# EAGLE design STEP CON Mk 05C - With Voltage Regulator (EAGLE 7.6.0)
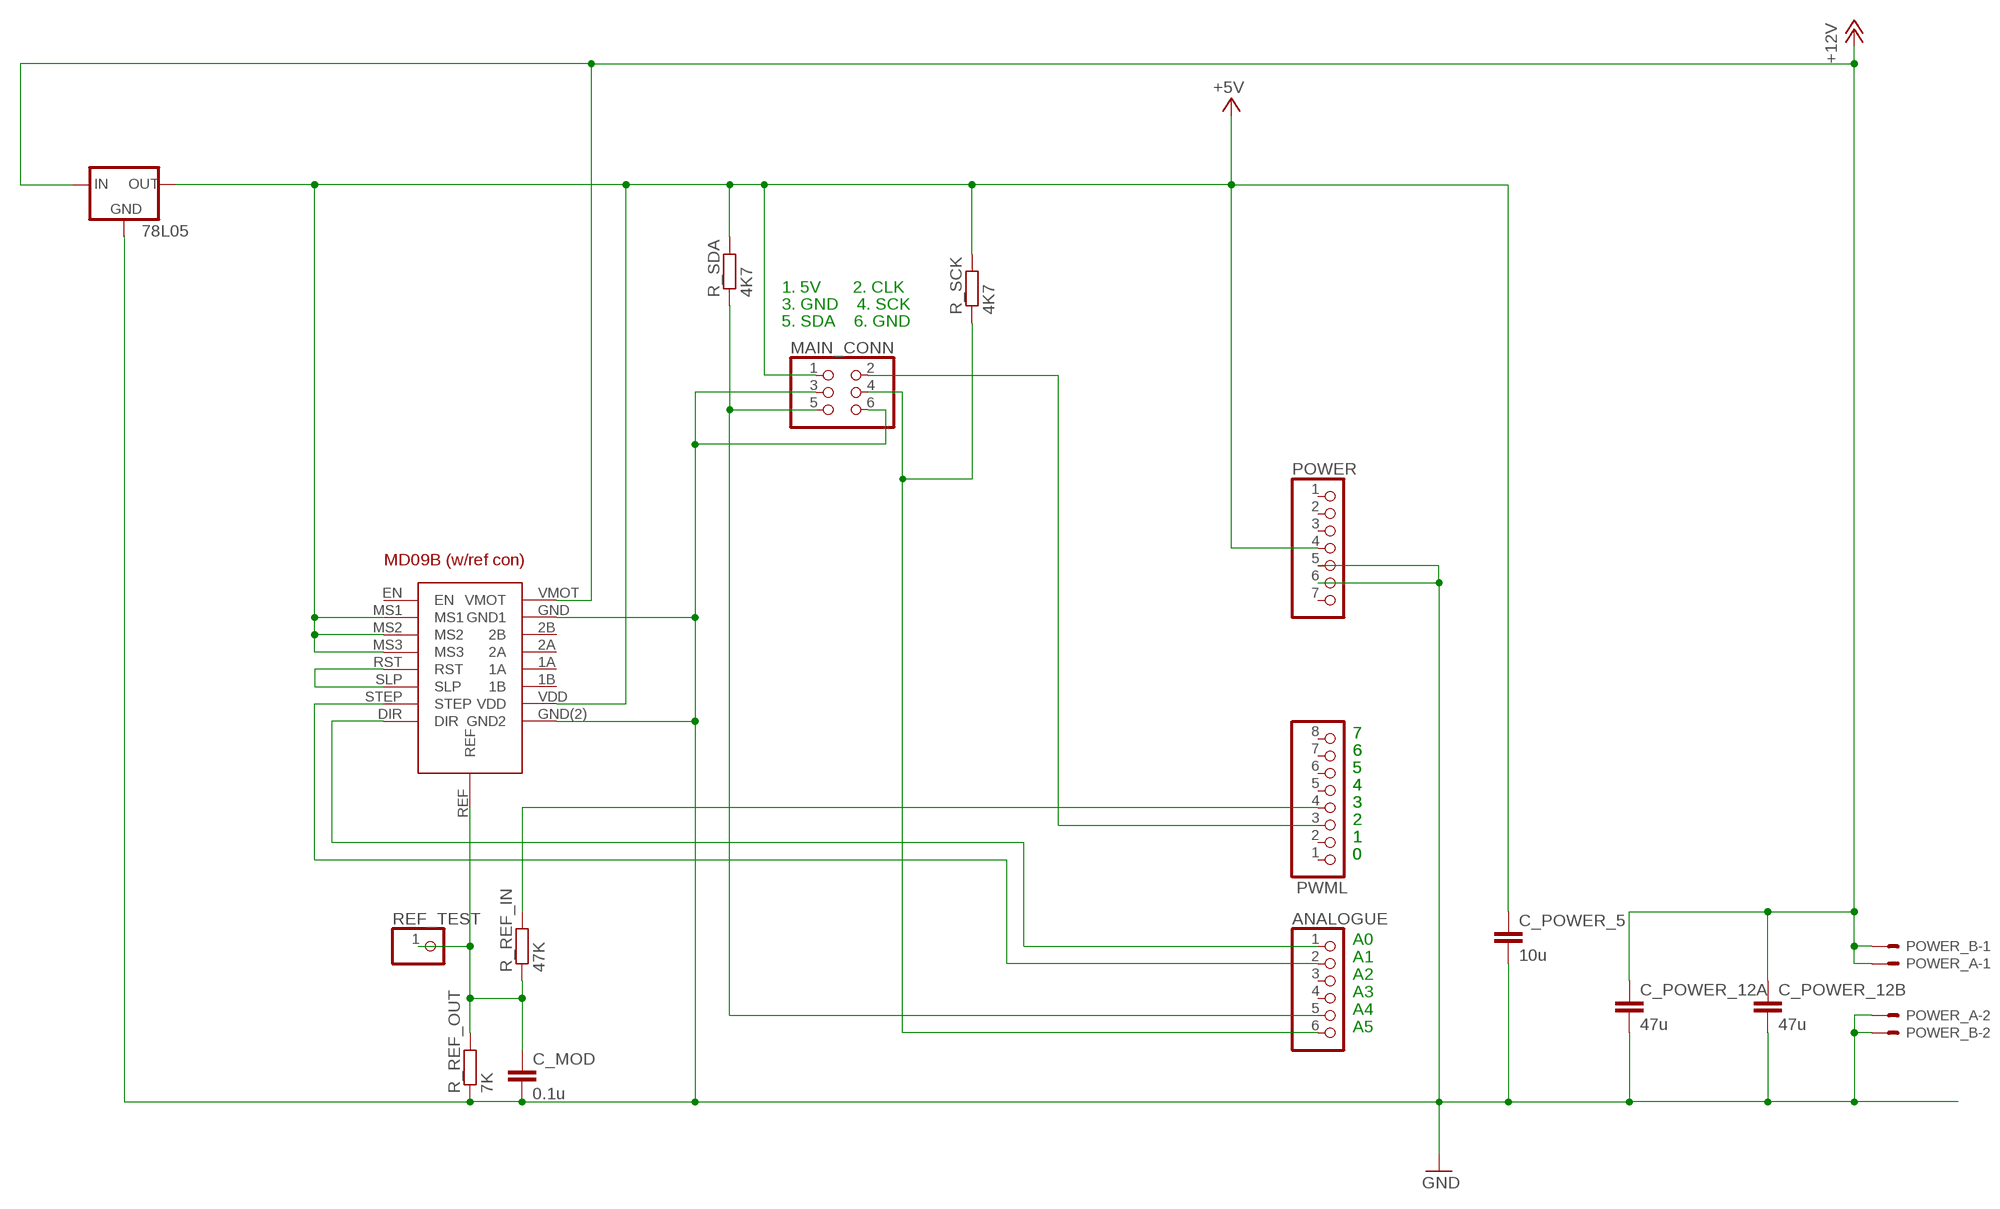
[diagram p0: schematic, sheet 1]

## Parts
78L05  78LXX  [78LXX]
ANALOGUE  PINHD-1X6  [1X06]
C_MOD  0.1u  C-EUC1206  [C1206]
C_POWER_5  10u  C-EUC1206  [C1206]
C_POWER_12A  47u  C-EUC1206  [C1206]
C_POWER_12B  47u  C-EUC1206  [C1206]
MAIN_CONN  PINHD-2X3  [2X03]
POWER  PINHD-1X7  [1X07]
POWER_A  KK-156-2  [KK-156-2]
POWER_B  KK-156-2  [KK-156-2]
PWML  PINHD-1X8  [1X08]
R_REF_IN  47K  R-EU_M0805  [M0805]
R_REF_OUT  7K  R-EU_M0805  [M0805]
R_SCK  4K7  R-EU_M0805  [M0805]
R_SDA  4K7  R-EU_M0805  [M0805]
REF_TEST  PINHD-1X1  [1X01]
U$1  MD09B_MOD_LP  [MD90B_MOD_LP]

## Nets
+5V [usbvcc]: 78L05.OUT C_POWER_5.1 MAIN_CONN.1 POWER.4 R_SCK.2 R_SDA.2 U$1.MS1 U$1.MS2 U$1.MS3 U$1.VDD
+12V: 78L05.IN C_POWER_12A.1 C_POWER_12B.1 POWER_A.1 POWER_B.1 U$1.VMOT
DIR: ANALOGUE.1 U$1.DIR
GND [gnd]: 78L05.GND C_MOD.2 C_POWER_5.2 C_POWER_12A.2 C_POWER_12B.2 MAIN_CONN.3 MAIN_CONN.6 POWER.5 POWER.6 POWER_A.2 POWER_B.2 R_REF_OUT.1 U$1.GND(2)(GND2) U$1.GND(GND1)
PWM: PWML.4 R_REF_IN.2
REF1: C_MOD.1 R_REF_IN.1 R_REF_OUT.2 REF_TEST.1 U$1.REF
SCK: ANALOGUE.6 MAIN_CONN.4 R_SCK.1
SDA: ANALOGUE.5 MAIN_CONN.5 R_SDA.1
SKYCLOCK: MAIN_CONN.2 PWML.3
SLP-RST: U$1.RST U$1.SLP
STEP: ANALOGUE.2 U$1.STEP
Unconnected: ANALOGUE.3 ANALOGUE.4 POWER.1 POWER.2 POWER.3 POWER.7 PWML.1 PWML.2 PWML.5 PWML.6 PWML.7 PWML.8 U$1.1A U$1.1B U$1.2A U$1.2B U$1.EN

## Notes on the sheet
- 1. 5V       2. CLK
  3. GND    4. SCK
  5. SDA    6. GND
- 7 | 7
- 6 | 6
- 5 | 5
- 4 | 4
- 3 | 3
- 2 | 2
- 1 | 1
- 0 | 0
- A0
  A1
  A2
  A3
  A4
  A5

## Library data of the parts
78L05 = v-reg:78LXX: VOLTAGE REGULATOR
ANALOGUE = pinhead - big pad:PINHD-1X6: PIN HEADER
C_MOD C_POWER_5 C_POWER_12A C_POWER_12B = rcl:C-EU: CAPACITOR, European symbol
MAIN_CONN = pinhead - big pad:PINHD-2X3: PIN HEADER
POWER = pinhead - big pad:PINHD-1X7: PIN HEADER
POWER_A POWER_B = con-molex:KK-156-2: KK 156 HEADER Source: http://www.molex.com/pdm_docs/sd/026604100_sd.pdf; OC_FARNELL: unknown; OC_NEWARK: unknown
PWML = pinhead:PINHD-1X8: PIN HEADER
R_REF_IN R_REF_OUT R_SCK R_SDA = rcl:R-EU_: RESISTOR, European symbol
REF_TEST = pinhead:PINHD-1X1: PIN HEADER
U$1 = pololu:MD09B_MOD_LP

## Net classes
1 power: width 0.61 mm, drill 0.711 mm, clearance 0.203 mm
2 gnd: width 0.305 mm, drill 0.711 mm, clearance 0.203 mm
3 usbvcc: width 0.508 mm, drill 0.711 mm, clearance 0.203 mm

## Board
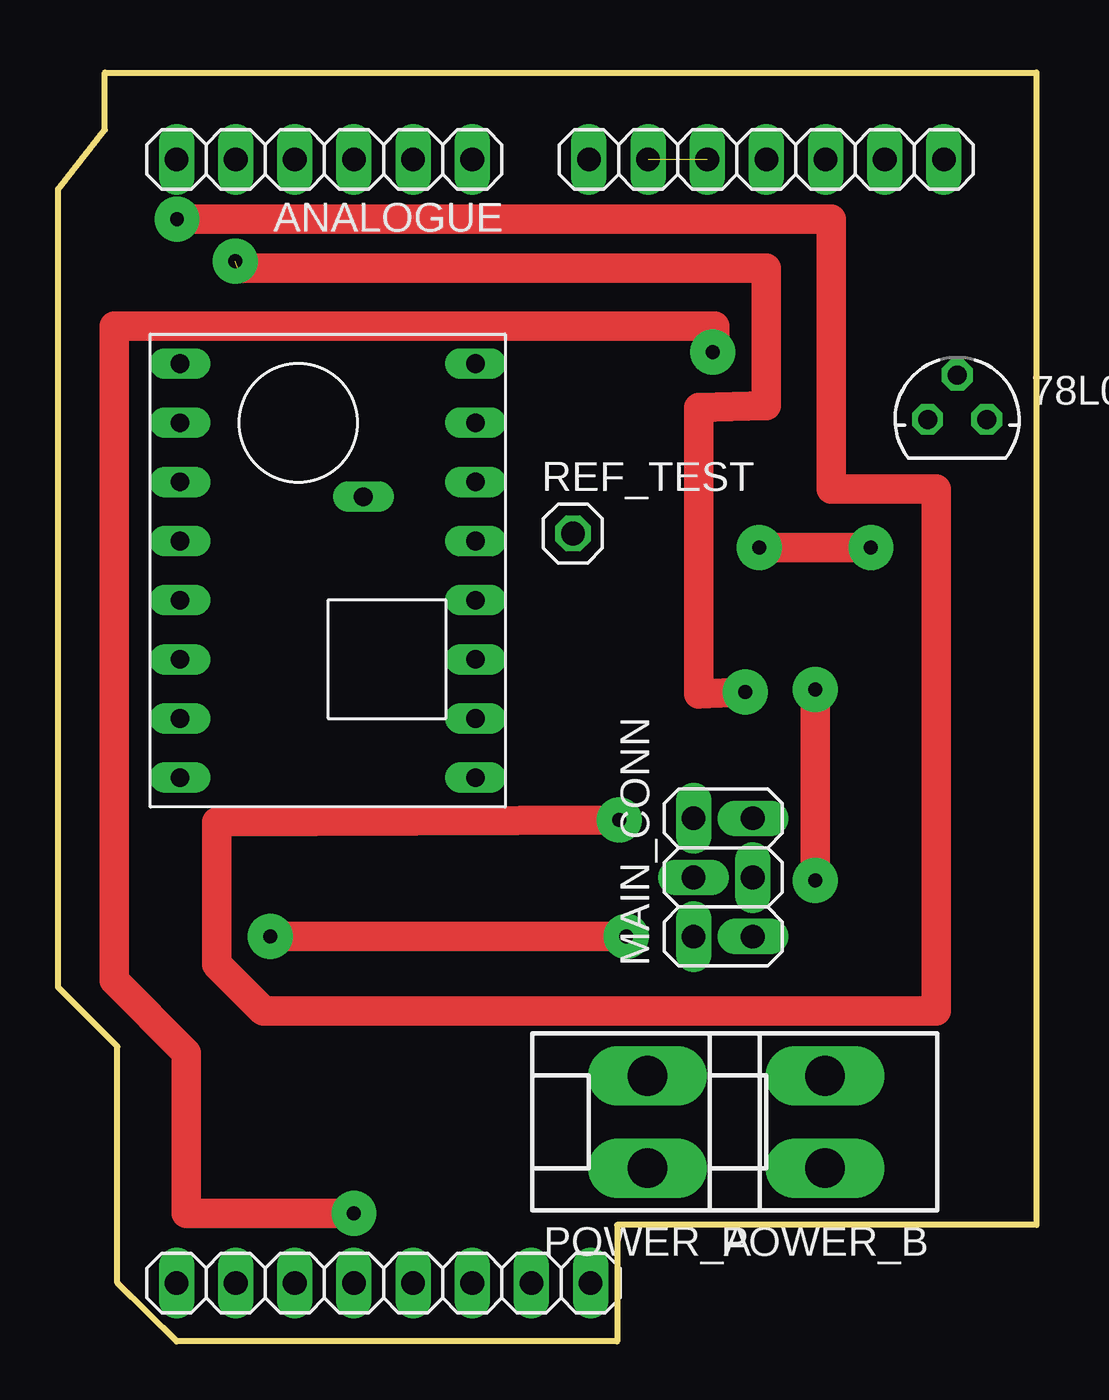
[diagram p1: board, top side]
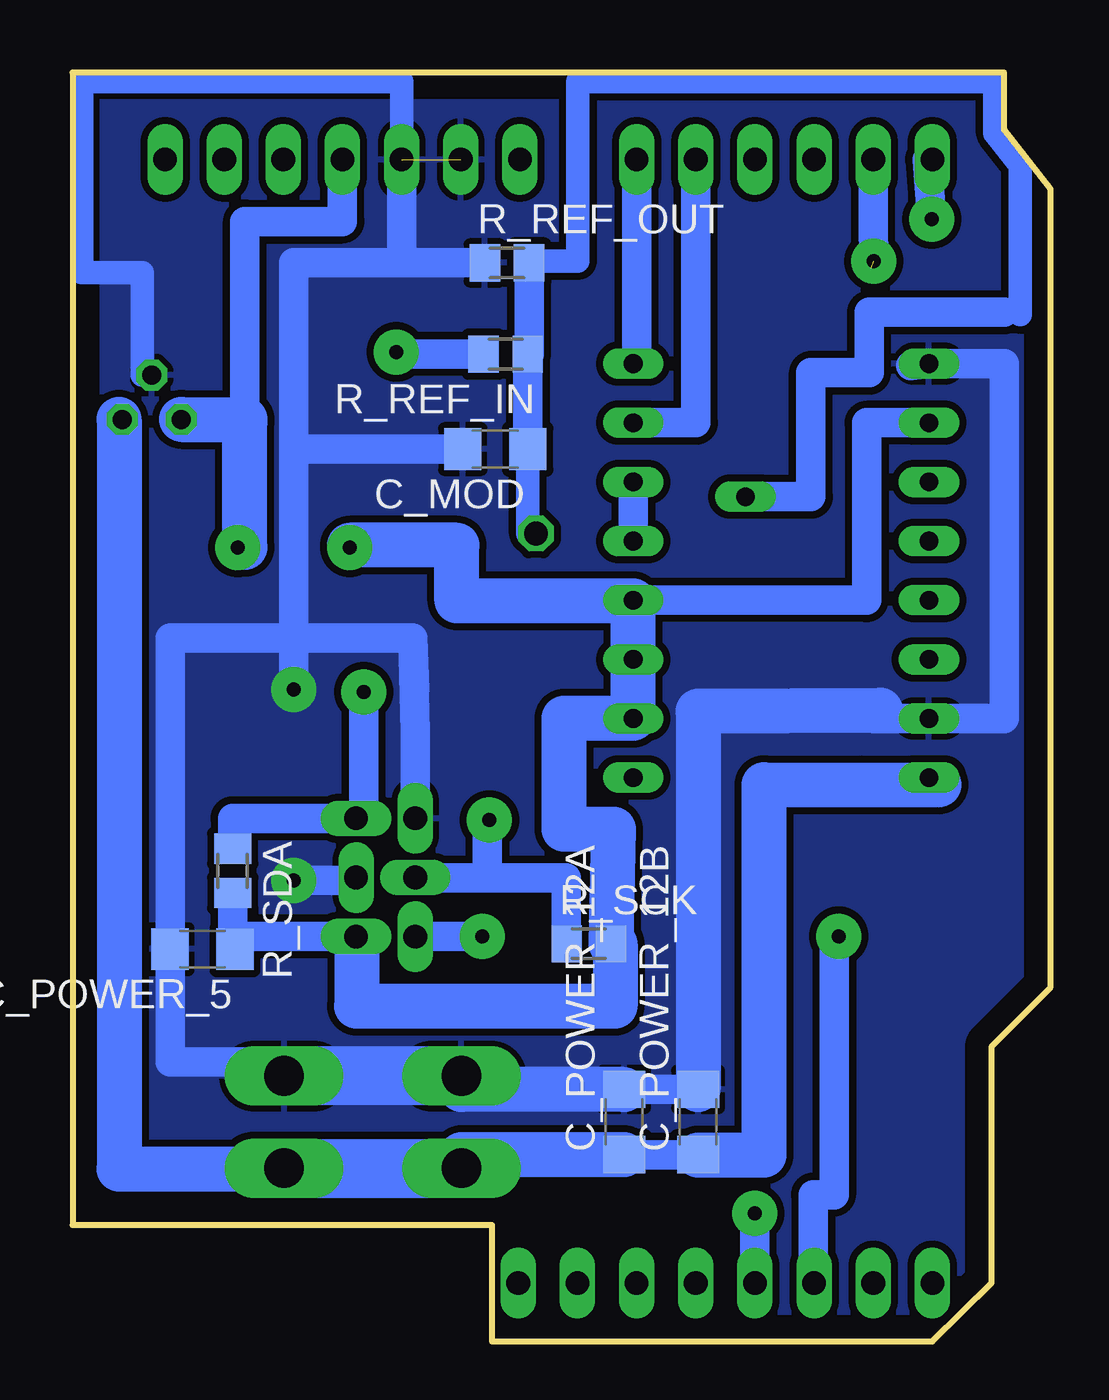
[diagram p2: board, bottom side, seen from below]

Size 42 x 54.5 mm. Coordinates in mm from the lower left corner, seen from the top.
Outline: 24,0 5.08,0 2.54,2.5 2.54,12.66 0,15.21 0,49.49 2,52.03 2,54.5 42,54.5 42,5 24,5 24,0
Copper layers (1*16): Top 0.035mm / dielectric 1.5mm / Bottom 0.035mm
Design rules "default *": minimum track width 8mil, minimum drill 16mil, track to track 12mil, track to pad 12mil, pad to pad 12mil, via to via 12mil, smd to smd 8mil, copper to edge 40mil, drill to drill 12mil, minimum pad ring 10mil, minimum via ring 10mil, stop-mask expansion 4mil, vias tented up to drill 0mil, thermal gap 10mil

### Footprints (pad centres in the part's own frame; a part is rotated, then mirrored left to right if it is on the bottom)
78LXX = drill 0.813 octagon: GND 0,1.905; IN 1.27,0; OUT -1.27,0
1X06 = drill 1.016 long: 1 -6.35,0; 2 -3.81,0; 3 -1.27,0; 4 1.27,0; 5 3.81,0; 6 6.35,0
C1206 = smd 1.6 x 1.8: 1 -1.4,0; 2 1.4,0
2X03 = drill 1.016 long: 1 -2.54,-1.27; 2 -2.54,1.27; 3 0,-1.27; 4 0,1.27; 5 2.54,-1.27; 6 2.54,1.27
1X07 = drill 1.016 long: 1 -7.62,0; 2 -5.08,0; 3 -2.54,0; 4 0,0; 5 2.54,0; 6 5.08,0; 7 7.62,0
KK-156-2 = drill 1.7 pad 2.184 long: 1 -1.98,0; 2 1.98,0
1X08 = drill 1.016 long: 1 -8.89,0; 2 -6.35,0; 3 -3.81,0; 4 -1.27,0; 5 1.27,0; 6 3.81,0; 7 6.35,0; 8 8.89,0
M0805 = smd 1.3 x 1.6: 1 -0.95,0; 2 0.95,0
1X01 = drill 1.016 octagon: 1 0,0
MD90B_MOD_LP = drill 0.8 long: 1A 6.35,-1.27; 1B 6.35,-3.81; 2A 6.35,1.27; 2B 6.35,3.81; DIR -6.35,-8.89; EN -6.35,8.89; GND 6.35,6.35; GND(2) 6.35,-8.89; MS1 -6.35,6.35; MS2 -6.35,3.81; MS3 -6.35,1.27; REF -1.524,-3.175; RST -6.35,-1.27; SLP -6.35,-3.81; STEP -6.35,-6.35; VDD 6.35,-6.35; VMOT 6.35,8.89

### Placement (x,y rotation side)
78L05  38.6,39.6 0 top
ANALOGUE  11.43,50.77 180 top
C_MOD  23.85,38.33 180 bottom
C_POWER_5  36.42,16.84 180 bottom
C_POWER_12A  18.32,9.42 90 bottom
C_POWER_12B  15.14,9.42 90 bottom
MAIN_CONN  28.55,19.93 90 top
POWER  30.41,50.77 180 top
POWER_A  25.3,9.42 90 top
POWER_B  32.92,9.42 90 top
PWML  13.97,2.5 0 top
R_REF_IN  23.41,42.41 180 bottom
R_REF_OUT  23.34,46.33 0 bottom
R_SCK  19.83,17.07 0 bottom
R_SDA  35.12,20.21 270 bottom
REF_TEST  22.1,34.7 0 top
U$1  11.57,33.1 180 top

### Tracks (layer width: path | path; a pad name or v marks a point on that pad's centre or on a via)
+5V  (via drill 0.6 pad 1.93)
  Top 1.27: v30.1,34.1 v34.9,34.1
  Bottom 1.016: MAIN_CONN.1 29.8,17.1 | 34.6,39.6 34.6,39.5
  Bottom 1.27: MAIN_CONN.1 35,17.39 | 35,17.39 35.12,17.39 R_SDA.2 | R_SCK.2 18.7,17.07 | 17.93,31.8 U$1.MS3 7.9,31.84 7.9,39.45 U$1.VDD | C_POWER_5.1 35,16.84 35,17.39 | 30.1,34.2 v30.1,34.1 | v34.9,34.1 34.6,34.1 | 34.6,39.5 34.6,48.1 30.41,48.1 POWER.4
  Bottom 1.93: 29.8,17.1 29.8,14.4 18.7,14.4 18.7,17.07 | R_SCK.2 18.78,22 20.9,22 20.9,26.75 U$1.MS1 U$1.MS2 17.93,31.8 25.5,31.8 25.5,34.2 30.1,34.2 | 34.6,34.1 34.6,39.5 | 78L05.OUT 34.6,39.6
+12V
  Bottom 1.016: 78L05.IN 40,39.6 | 32.4,7.4 32.4,7.44
  Bottom 1.27: 25.3,8.02 POWER_A.1 | C_POWER_12A.1 C_POWER_12B.1 15.14,8 | 4.8,23.9 8.2,24.21 U$1.VMOT
  Bottom 1.93: C_POWER_12A.1 25.3,8.02 | 15.14,8 12.3,8 12.3,23.91 4.8,23.9 | 40,39.6 40,7.4 32.4,7.4
  Bottom 2.54: POWER_B.1 32.4,7.44 POWER_A.1
DIR
  Bottom 1.27: U$1.DIR 17.78,41.99 ANALOGUE.1
GND  (via drill 0.6 pad 1.93)  (1 unrouted)
  Top 1.27: v32.5,19.8 v32.5,28
  Bottom 1.016: 78L05.GND 39,41.51 39,45.9 41.6,45.9 41.6,54.1 27.87,54.1 POWER.5
  Bottom 1.27: 25.3,10.82 POWER_A.2 | 6,41.9 U$1.GND(2) 2,42 2,26.75 U$1.GND 7.6,26.75 7.3,27.1 | POWER_B.2 32.92,12 37.8,12 37.8,16.84 | 37.8,16.84 37.8,30.2 32.5,30.2 | 32.5,30.2 27.4,30.2 | MAIN_CONN.3 29.82,19.8 v32.5,19.8 | 27.3,28 27.4,30.2 | C_POWER_12B.2 C_POWER_12A.2 | 27.87,46.33 32.5,46.33 32.5,38.33 | 32.5,38.33 32.5,30.2 | C_MOD.2 32.5,38.33 | C_POWER_5.2 37.8,16.84 | R_REF_OUT.1 27.87,46.33 | 27.87,46.33 POWER.5 | 27.4,30.2 27.29,26.2 MAIN_CONN.6 | v32.5,28 32.5,30.2
  Bottom 1.93: C_POWER_12A.2 25.3,10.82 | 7.3,27.1 15.14,27.05 C_POWER_12B.2
  Bottom 2.54: POWER_A.2 POWER_B.2
  pour Bottom: 2,54.5 42,54.5 42,5.1 24,5 24,0 5.2,0 2.54,2.5 2.54,12.6 0,15.1 0,49.5 2,52.1
PWM  (via drill 0.6 pad 1.93)
  Top 1.27: v28.1,42.5 28.2,42.5 28.2,43.6 2.4,43.6 2.4,15.5 5.5,12.4 5.5,5.5 v12.7,5.5
  Bottom 1.27: R_REF_IN.2 28.1,42.41 v28.1,42.5 | PWML.4 v12.7,5.5
REF1
  Bottom 0.61: 2,44.2 1.3,44.1 | 22.39,46.4 R_REF_OUT.2
  Bottom 1.016: 1.3,44.1 1.3,50.5 2.4,51.9 2.4,54.1 20.3,54.1 20.3,46.4 22.39,46.4 | REF_TEST.1 22.45,34.7 C_MOD.1
  Bottom 1.27: U$1.REF 10.3,36.28 10.3,41.6 7.8,41.6 7.8,44.2 2,44.2 | R_REF_OUT.2 22.39,42.41 R_REF_IN.1 C_MOD.1
SCK  (via drill 0.6 pad 1.93)
  Top 1.27: v5.1,48.2 33.2,48.2 33.2,36.6 37.7,36.6 37.7,14.2 8.8,14.2 6.8,16.2 6.8,22.3 v24.1,22.4
  Bottom 1.27: R_SCK.1 20.8,17.07 20.8,19.9 24.2,19.9 | 24.2,19.9 27.29,19.9 MAIN_CONN.4 | ANALOGUE.6 5.3,50.77 v5.1,48.2 | v24.1,22.4 24.2,22.3 24.2,19.9
SDA  (via drill 0.6 pad 1.93)  (1 unrouted)
  Top 1.27: v29.5,27.9 27.5,27.8 27.5,40.1 30.4,40.2 30.4,46.1 7.7,46.1
  Bottom 1.27: R_SDA.1 35.12,22.46 MAIN_CONN.5 29.5,22.46 v29.5,27.9 | v7.6,46.4 7.62,48.1 ANALOGUE.5
SKYCLOCK  (via drill 0.6 pad 1.93)
  Top 1.27: v24.4,17.4 v9.1,17.4
  Bottom 1.27: MAIN_CONN.2 v24.4,17.4 | v9.1,17.4 9.3,17.4 9.3,6.3 10.2,6.3 10.2,2.5 PWML.3
SLP-RST
  Bottom 1.27: U$1.SLP U$1.RST
STEP
  Bottom 1.27: U$1.STEP 15.24,39.45 ANALOGUE.2